# EAGLE design untitled (EAGLE 7.2.0)
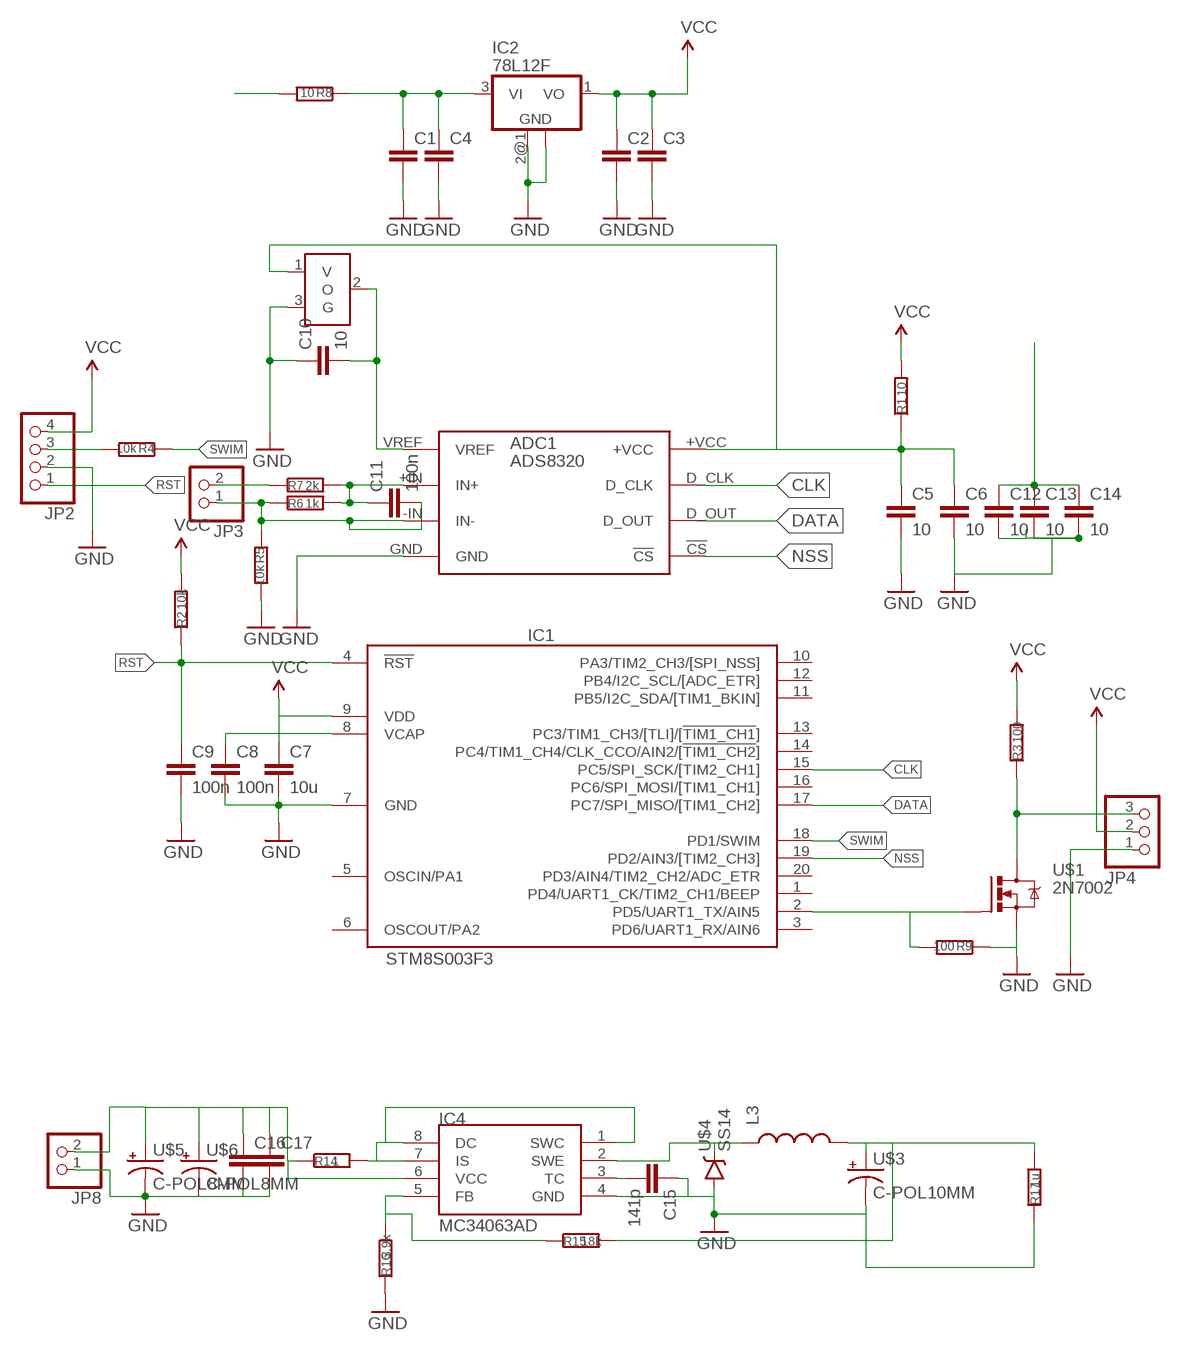
[diagram p0: schematic, sheet 1]

## Parts
ADC1  ADS8320  [S-PDSO-G8]
C1  CC0805  [C0805]
C2  CC0805  [C0805]
C3  CC0805  [C0805]
C4  CC0805  [C0805]
C5  10  CC0805  [C0805]
C6  10  CC0805  [C0805]
C7  10u  CC0805  [C0805]
C8  100n  CC0603  [C0603]
C9  100n  CC0603  [C0603]
C10  10  CC0805  [C0805]
C11  100n  CC0603  [C0603]
C12  10  CC0805  [C0805]
C13  10  CC0805  [C0805]
C14  10  CC0805  [C0805]
C15  141p  CC0603  [C0603]
C16  CC0805  [C0805]
C17  CC0805  [C0805]
IC1  STM8S003F3  [TSSOP20]
IC2  78L12F  [SOT89]
IC4  MC34063AD  [SOIC8]
JP2  PINHD-1X04_2.54  [1X04]
JP3  PINHD-1X2  [1X02]
JP4  PINHD-1X03_2.54  [1X03]
JP8  PINHD-1X02_2.54  [1X02]
L3  INDUCTORSRU1038  [SRU1038]
R1  10  R0603  [0603]
R2  10k  R0603  [0603]
R3  100  R0603  [0603]
R4  10k  R0603  [0603]
R5  10k  R0603  [0603]
R6  1k  R0603  [0603]
R7  2k  R0603  [0603]
R8  10  R0603  [0603]
R9  100  R0603  [0603]
R14  1  R0805  [R0805]
R15  18k  R0603  [0603]
R16  3.9k  R0603  [0603]
R17  1u  R0805  [R0805]
U$1  2N7002  [SOT23]
U$2  REF3025  [SOT23]
U$3  C-POL10MM  [PCAP10]
U$4  SS14  [SMA-DIODE]
U$5  C-POL8MM  [PCAP8]
U$6  C-POL8MM  [PCAP8]

## Nets
CLK: ADC1.D_CLK IC1.15(PC5/SPI_SCK/[TIM2_CH1])
DATA: ADC1.D_OUT IC1.17(PC7/SPI_MISO/[TIM1_CH2])
GND: ADC1.GND C1.2 C2.2 C3.2 C4.2 C5.2 C6.2 C7.2 C8.2 C9.2 C10.1 C12.2 C13.2 C14.2 C15.1 C16.2 C17.2 IC1.7(GND) IC2.2(GND) IC2.2@1(GND) IC4.4(GND) JP2.2 JP4.1 JP8.1 R5.2 R9.1 R16.1 R17.1 U$1.2(S) U$2.3(G) U$3.P$2(-) U$4.A U$5.P$2(-) U$6.P$2(-)
N$1: ADC1.VREF C10.2 U$2.2(O)
N$2: C1.1 C4.1 C12.1 C13.1 C14.1 IC2.3(VI) L3.2 R8.1 R15.2 R17.2 U$3.P$1(+)
N$3: ADC1.+VCC C5.1 C6.1 R1.1 U$2.1(V)
N$4: C8.1 IC1.8(VCAP)
N$5: IC1.2(PD5/UART1_TX/AIN5) R9.2 U$1.1(G)
N$6: JP4.3 R3.1 U$1.3(D)
N$7: C16.1 C17.1 IC4.6(VCC) JP8.2 R14.1 U$5.P$1(+) U$6.P$1(+)
N$8: ADC1.-IN(IN-) C11.2 JP3.1 R5.1 R6.1
N$9: ADC1.+IN(IN+) C11.1 R6.2 R7.2
N$10: JP3.2 R7.1
N$11: R8.2
N$18: C15.2 IC4.3(TC)
N$19: IC4.2(SWE) L3.1 U$4.C
N$21: IC4.5(FB) R15.1 R16.2
N$24: IC4.1(SWC) IC4.7(IS) IC4.8(DC) R14.2
NSS: ADC1.!CS IC1.19(PD2/AIN3/[TIM2_CH3])
RST: C9.1 IC1.4(!RST) JP2.1 R2.1
SWIM: IC1.18(PD1/SWIM) R4.1
SWIMR: JP2.3 R4.2
VCC: C2.1 C3.1 C7.1 IC1.9(VDD) IC2.1(VO) JP2.4 JP4.2 R1.2 R2.2 R3.2
Unconnected: IC1.1(PD4/UART1_CK/TIM2_CH1/BEEP) IC1.3(PD6/UART1_RX/AIN6) IC1.5(OSCIN/PA1) IC1.6(OSCOUT/PA2) IC1.10(PA3/TIM2_CH3/[SPI_NSS]) IC1.11(PB5/I2C_SDA/[TIM1_BKIN]) IC1.12(PB4/I2C_SCL/[ADC_ETR]) IC1.13(PC3/TIM1_CH3/[TLI]/[!TIM1_CH1!]) IC1.14(PC4/TIM1_CH4/CLK_CCO/AIN2/[!TIM1_CH2!]) IC1.16(PC6/SPI_MOSI/[TIM1_CH1]) IC1.20(PD3/AIN4/TIM2_CH2/ADC_ETR)

## Library data of the parts
ADC1 = ADC:ADS8320
C1-C17 = CasaLibrary:C: Capacitor
IC1 = CasaLibrary:STM8S003: Value line, 16 MHz STM8S 8-bit MCU, 8 Kbytes Flash, 128 bytes data EEPROM, 10-bit ADC, 3 timers, UART, SPI, I2C
IC2 = linear:78L*: POSITOIV-VOLTAGE REGULATORS Output up to 100 mA Source: Datasheet <http://focus.ti.com/lit/ds/symlink/ua78l05.pdf>
IC4 = CasaLibrary:MC34063
JP2 = pinhead-2:PINHD-1X04: PIN HEADER
JP3 = pinhead:PINHD-1X2: PIN HEADER
JP4 = pinhead-2:PINHD-1X03: PIN HEADER
JP8 = pinhead-2:PINHD-1X02: PIN HEADER
L3 = SparkFun-Passives:INDUCTOR: Inductors Basic Inductor/Choke - 0603 and 1206. Footprints are not proven and vary greatly between part numbers. INDUCTOR POWER 3.3UH 4.0A SMD 0.197" L x 0.197" W x 0.177" H (5.00mm x 5.00mm x 4.50mm)
R1-R9 R14-R17 = CasaLibrary:R
U$1 = CasaLibrary:2N7002
U$2 = ADC:REF3025
U$3 U$5 U$6 = CasaLibrary:C-POL
U$4 = CasaLibrary:SS14

## Board
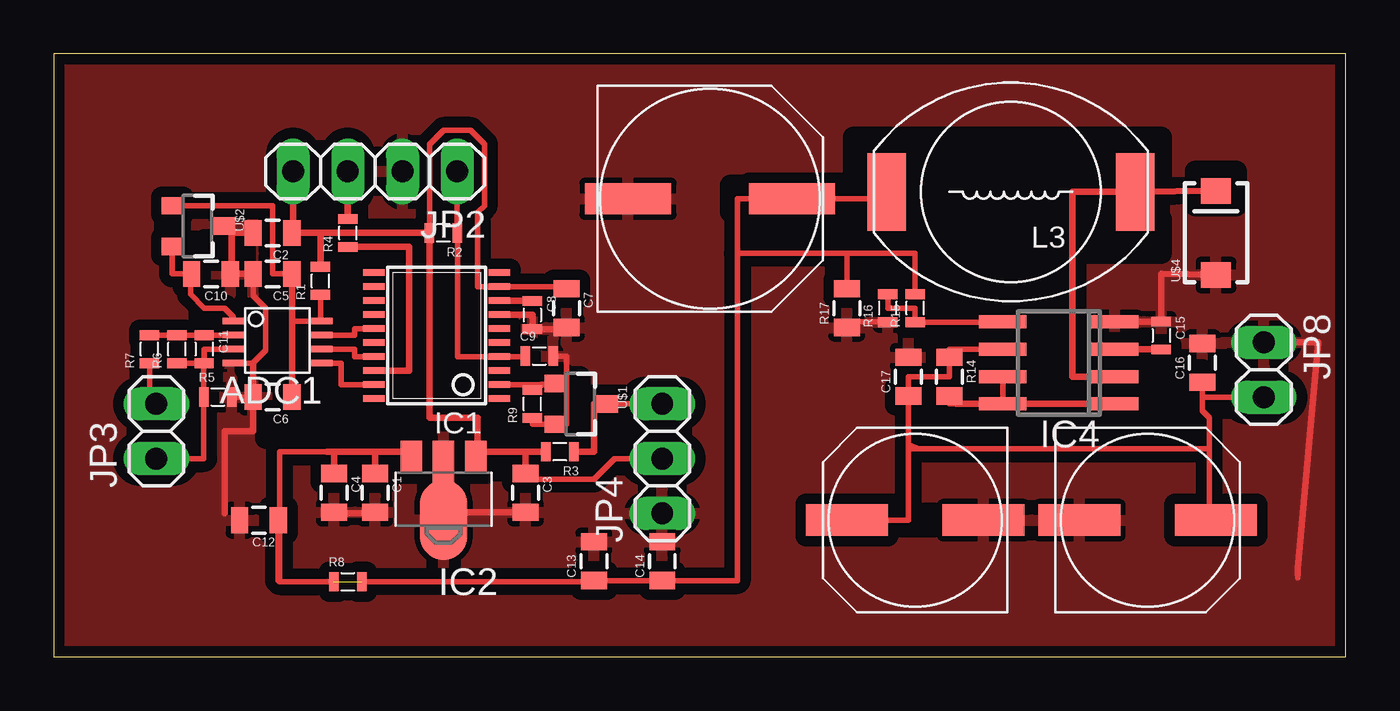
[diagram p1: board, top side]

Size 60 x 28 mm. Coordinates in mm from the lower left corner, seen from the top.
Outline: 0,0 60,0 60,28 0,28 0,0
Copper layers (1*16): Top 0.035mm / dielectric 1.5mm / Bottom 0.035mm
Design rules "default": minimum track width 0.2mm, minimum drill 0.2mm, track to track 0.2mm, track to pad 0.2mm, pad to pad 0.2mm, via to via 0.2mm, smd to smd 0.2mm, copper to edge 0.2mm, drill to drill 0.2mm, minimum pad ring 10mil, minimum via ring 8mil, stop-mask expansion 4mil, vias tented up to drill 0mil, thermal gap 10mil
tRestrict: area 45.4,12.4 to 47,16.2; area 51.1,11.7 to 53.3,13.3; area 37.8,19.7 to 51.1,23.5; area 37.1,21.9 to 51.4,24.1; area 47.3,18.7 to 51.4,20.3; area 53,21 to 54.9,22.5; area 7,18.4 to 8.9,19.4; area 20.3,9.8 to 22.2,11.7; area 23.2,10.5 to 24.4,13; area 13.3,10.2 to 17.1,12.4; area 11.1,10.2 to 13.3,12.4; area 9.8,10.2 to 11.4,11.4; 3 more areas

### Footprints (pad centres in the part's own frame; a part is rotated, then mirrored left to right if it is on the bottom)
S-PDSO-G8 = smd 1 x 0.305: !CS 3.55,-2.55; +IN -0.55,-1.25; +VCC 3.55,-0.6; -IN -0.55,-1.9; D_CLK 3.55,-1.25; D_OUT 3.55,-1.9; GND -0.55,-2.55; VREF -0.55,-0.6
C0805 = smd 0.8 x 1.2: 1 -0.9,0; 2 0.9,0
C0603 = smd 0.45 x 0.9: 1 -0.65,0; 2 0.65,0
TSSOP20 = smd 0.305 x 0.991: 1 -2.925,-2.918; 2 -2.275,-2.918; 3 -1.625,-2.918; 4 -0.975,-2.918; 5 -0.325,-2.918; 6 0.325,-2.918; 7 0.975,-2.918; 8 1.625,-2.918; 9 2.275,-2.918; 10 2.925,-2.918; 11 2.925,2.918; 12 2.275,2.918; 13 1.625,2.918; 14 0.975,2.918; 15 0.325,2.918; 16 -0.325,2.918; 17 -0.975,2.918; 18 -1.625,2.918; 19 -2.275,2.918; 20 -2.925,2.918
SOT89 = smd 1 x 1.5: 1 -1.499,-1.981; 3 1.499,-1.981 | smd 1 x 2: 2 0,-1.727 | smd 2.2 x 3.7: 2@1 0,0.94
SOIC8 = smd 0.6 x 2.2: 1 -1.905,-2.6; 2 -0.635,-2.6; 3 0.635,-2.6; 4 1.905,-2.6; 5 1.905,2.6; 6 0.635,2.6; 7 -0.635,2.6; 8 -1.905,2.6
1X04 = drill 1.016 long: 1 -3.81,0; 2 -1.27,0; 3 1.27,0; 4 3.81,0
1X02 = drill 1.016 long: 1 -1.27,0; 2 1.27,0
1X03 = drill 1.016 long: 1 -2.54,0; 2 0,0; 3 2.54,0
SRU1038 = smd 1.8 x 3.6: 1 -5.77,0; 2 5.77,0
0603 = smd 0.45 x 0.9: 1 -0.65,0; 2 0.65,0
R0805 = smd 0.8 x 1.2: 1 -0.9,0; 2 0.9,0
SOT23 = smd 0.8 x 1: 1 -0.95,-1.159; 2 0.95,-1.159; 3 0,1.259
PCAP10 = smd 4 x 1.46: P$1 -3.81,0; P$2 3.81,0
SMA-DIODE = smd 1.2 x 1.4: A -1.95,0; C 1.95,0
PCAP8 = smd 3.8 x 1.46: P$1 -3.175,0; P$2 3.175,0

### Placement (x,y rotation side)
ADC1  8.89,16.19 0 top
C1  14.92,7.62 270 top
C2  10.16,19.68 180 top
C3  21.91,7.62 270 top
C4  13.02,7.62 270 top
C5  10.16,17.78 180 top
C6  10.16,12.06 180 top
C7  23.81,16.19 270 top
C8  22.23,15.88 270 top
C9  22.54,13.97 0 top
C10  7.3,17.78 180 top
C11  6.99,14.29 270 top
C12  9.53,6.35 180 top
C13  25.08,4.45 90 top
C14  28.26,4.45 90 top
C15  51.44,14.92 270 top
C16  53.34,13.65 90 top
C17  39.69,13.02 90 top
IC1  17.78,14.92 90 top
IC2  18.1,7.3 180 top
IC4  46.67,13.65 90 top
JP2  14.92,22.54 180 top
JP3  4.76,10.48 90 top
JP4  28.26,9.21 90 top
JP8  56.2,13.34 270 top
L3  44.45,21.59 180 top
R1  12.38,17.46 90 top
R2  18.1,19.68 180 top
R3  23.5,9.53 180 top
R4  13.65,19.68 90 top
R5  7.62,12.06 0 top
R6  5.71,14.29 90 top
R7  4.45,14.29 90 top
R8  13.65,3.49 0 top
R9  22.23,11.75 90 top
R14  41.59,13.02 270 top
R15  40.01,16.19 90 top
R16  38.73,16.19 90 top
R17  36.83,16.19 90 top
U$1  24.45,11.75 270 top
U$2  6.67,20 270 top
U$3  30.48,21.27 180 top
U$4  53.98,19.68 90 top
U$5  50.8,6.35 180 top
U$6  40.01,6.35 0 top

### Tracks (layer width: path | path; a pad name or v marks a point on that pad's centre or on a via)
CLK
  Top 0.254: IC1.15 13.97,15.25 13.97,14.94 ADC1.D_CLK
DATA
  Top 0.254: ADC1.D_OUT 13.97,14.29 13.97,13.95 IC1.17
GND
  Top 0.254: U$2.3 8.26,19.68 8.26,17.46 C10.1 8.2,17.73 8.26,17.78 | ADC1.GND 9.26,13.64 9.26,13.65 9.84,14.23 9.84,16.19 9.26,16.77 C5.2 | R5.2 C6.2 | 57.78,3.67 57.78,4.13 | C9.2 23.81,13.97 23.81,10.8 U$1.2 22.23,10.8 R9.1 | R17.1 36.83,15.56 38.73,15.56 R16.1
  Top 0.305: 9.26,13.65 C6.2 9.26,10.48 7.94,10.48 7.94,6.67 | C2.2 8.26,19.68 8.26,17.78 C5.2 | C4.2 13.02,6.67 14.92,6.67 C1.2 | IC2.2@1 18.45,6.72 C3.2 | IC1.7 22.23,15.9 C8.2 23.81,15.22 C7.2 | IC4.4 49.29,15.57 C15.1 51.44,17.78 U$4.A | JP8.1 58.74,14.61 57.78,4.13 57.78,3.81
  pour Top (isolate 0.5): 0,27.94 60.01,27.94 60.01,-0.32 0,-0.32
N$1
  Top 0.254: ADC1.VREF 8.34,15.79 7.94,16.19 6.99,16.19 6.35,16.83 6.35,17.73 C10.2 5.51,17.78 U$2.2
N$2  (1 unrouted)
  Top 0.254: 10.48,3.49 10.48,9.53 12.7,9.53 | C12.1 10.43,3.54 10.48,3.49 | 38.42,21.59 L3.2 38.68,21.27 U$3.P$1 31.75,21.27 31.75,18.73 | 31.75,18.73 31.75,3.54 C14.1 C13.1 25.08,3.49 14.29,3.49 | R15.2 40.01,18.73 36.83,18.73 | 36.83,18.73 31.75,18.73 | R17.2 36.83,18.73 | 10.48,3.49 R8.1
  Top 0.305: IC2.3 16.6,9.53 14.92,9.53 | 14.92,9.53 C1.1 | C4.1 13.02,9.53 | 13.02,9.53 14.92,9.53 | 12.7,9.53 13.02,9.53 | L3.2 38.73,21.59
N$3
  Top 0.254: 11.06,15.59 ADC1.+VCC 12.38,15.65 R1.1 | C5.1 10.16,17.78 10.16,20.95 6.35,20.95 U$2.1
  Top 0.305: C6.1 11.06,15.59 C5.1
N$4
  Top 0.305: IC1.8 22.23,16.55 C8.1
N$5
  Top 0.254: IC1.2 22.23,12.65 | 22.65,12.65 22.23,12.65 | 22.23,12.65 R9.2
  Top 0.305: 22.65,12.65 U$1.1
N$6
  Top 0.254: JP4.3 U$1.3
  Top 0.305: R3.1 25.08,9.53 25.08,11.75 U$1.3
N$7
  Top 0.254: 39.69,9.84 40.15,9.67 | 40.15,9.67 53.66,9.67 | U$5.P$1 53.66,6.67 53.66,9.67 | IC4.6 41.59,14.29 R14.1 41.59,13.02 39.69,13.02 C17.1 39.69,9.84 | U$6.P$1 39.69,6.35 39.69,9.67 | JP8.2 53.34,12.06 | 53.34,12.06 C16.1 | 53.66,9.67 53.66,11.11 53.34,11.43 53.34,12.06 | 40.15,9.67 39.69,9.67 | 39.69,9.67 39.69,9.84
N$8
  Top 0.254: ADC1.-IN 6.99,14.29 C11.2 | R6.1 C11.2 | C11.2 6.97,13.64 R5.1 6.97,9.21 JP3.1
N$9
  Top 0.254: R7.2 R6.2 C11.1 ADC1.+IN
N$10
  Top 0.254: JP3.2 4.45,11.75 R7.1
N$18
  Top 0.305: IC4.3 51.42,14.29 C15.2
N$19
  Top 0.305: U$4.C L3.1 47.31,21.59 47.31,13.02 IC4.2
N$21
  Top 0.254: R16.2 38.73,16.19 40.01,16.19 R15.1 44.07,15.54 IC4.5
N$24
  Top 0.254: IC4.7 IC4.8 | 41.91,11.75 41.59,11.75 R14.2
  Top 0.305: 41.91,11.75 IC4.8 IC4.1
NSS
  Top 0.254: ADC1.!CS 13.34,13.64 13.34,12.65 IC1.19
RST
  Top 0.254: 21.89,13.95 IC1.4 18.75,13.95 R2.1 18.73,19.68 JP2.1 19.37,22.54
  Top 0.305: 21.89,13.95 C9.1
SWIM
  Top 0.305: IC1.18 16.51,13.3 16.51,19.04 R4.1
SWIMR
  Top 0.305: JP2.3 R4.2
VCC
  Top 0.254: JP4.2 26.04,9.21 25.08,8.26 22.17,8.26 C3.1 | R2.2 17.45,23.8 18.1,24.45 19.37,24.45 20,23.81 20,20.95 19.68,20.64 19.68,17.2 IC1.9 23.71,17.2 | 23.71,17.2 arc-90 C7.1 arc90 23.71,17.2
  Top 0.305: C2.1 11.11,19.68 | C3.1 21.91,9.53 | 21.91,9.53 19.68,9.53 | 19.68,9.53 19.68,9.28 IC2.1 | 19.68,9.53 19.68,11.11 17.46,11.11 17.46,19.68 R2.2 12.38,19.68 | 12.38,19.68 11.11,19.68 | R3.2 21.91,9.53 | JP2.4 11.11,19.68 | R1.2 12.38,19.68

### Text on the board
tRestrict: test